# Altium schematic sheet SlotCarChannel.SchDoc
size A
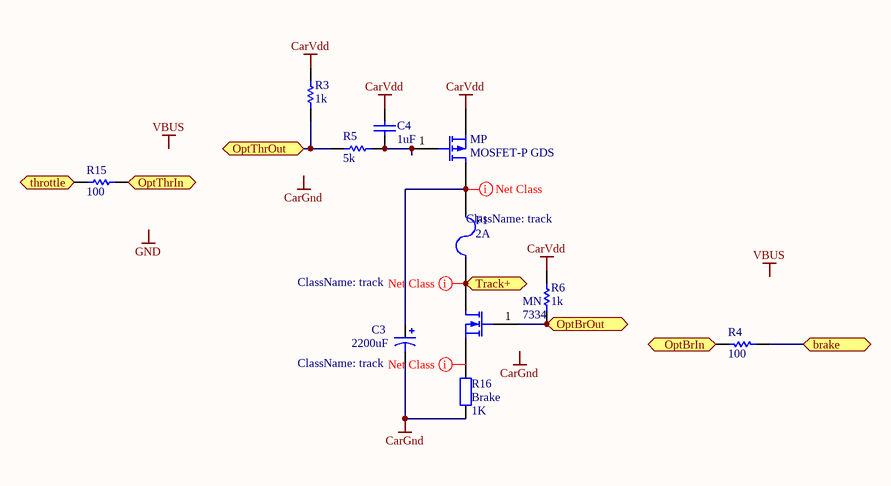
[diagram p0: SlotCarChannel.SchDoc]

## Parts
C3  2200uF  [CAPPR5-12.5x35]
C4  1uF  [CC1608-0603]
F1  2A  [2920Littelfuse]
MN  7334  [TO220_HEATSINK]
MP  MOSFET-P GDS  [TO220_HEATSINK]
R3  1k  [CR1608-0603]
R4  100  [CR1608-0603]
R5  5k  [CR1608-0603]
R6  1k  [CR1608-0603]
R15  100  [CR1608-0603]
R16  Brake  value 1K  [Axial 0.4]

## Ports
brake, OptBrIn, OptBrOut, OptThrIn, OptThrOut, throttle, Track+

## Nets
CarGnd: C3.2 R16.1
CarVdd: C4.2 MP.3(S) R3.1 R6.1
brake: R4.1 ; port brake
OptBrIn: R4.2 ; port OptBrIn
OptBrOut: MN.1(G) R6.2 ; port OptBrOut
OptThrIn: R15.2 ; port OptThrIn
OptThrOut: R3.2 R5.2 ; port OptThrOut
throttle: R15.1 ; port throttle
Track+: F1.1 MN.2(D) ; port Track+
NetC3_1: C3.1 F1.2 MP.2(D)
NetC4_1: C4.1 MP.1(G) R5.1
NetMN_3: MN.3(S) R16.2

## Layout directives
net class track; rule Undefined: NetC3_1, NetMN_3, Track+

## Notes on the sheet
- Labels drawn without touching a wire or pin: CarGnd, GND, VBUS

## Library data of the parts
C3 = Cap Pol1: Polarized Capacitor (Radial); Value: 100pF; Published: 8-Jun-2000; LatestRevisionDate: 17-Jul-2002; LatestRevisionNote: Re-released for DXP Platform.; PackageReference: RB7.6-15; Publisher: Altium Limited
C4 = Cap Semi: Capacitor (Semiconductor SIM Model); Value: 100pF; Published: 8-Jun-2000; LatestRevisionDate: 17-Jul-2002; LatestRevisionNote: Re-released for DXP Platform.; PackageReference: C1206; Publisher: Altium Limited
F1 = Fuse 2: Fuse; Published: 8-Jun-2000; LatestRevisionDate: 17-Jul-2002; LatestRevisionNote: Re-released for DXP Platform.; PackageReference: PIN-W2/E2.8; Publisher: Altium Limited
MN = MOSFET-N-GDS: N-Channel MOSFET; PackageDocument: 1995/1996; Published: 8-Jun-2000; LatestRevisionDate: 17-Jul-2002; LatestRevisionNote: Re-released for DXP Platform.; PackageReference: E3; Publisher: Altium Limited
MP = MOSFET-P-GDS: P-Channel MOSFET; PackageDocument: 1995/1996; Published: 8-Jun-2000; LatestRevisionDate: 17-Jul-2002; LatestRevisionNote: Re-released for DXP Platform.; PackageReference: E3; Publisher: Altium Limited
R3 R6 = Res Semi: Semiconductor Resistor; Published: 8-Jun-2000; LatestRevisionDate: 17-Jul-2002; LatestRevisionNote: Re-released for DXP Platform.; PackageReference: AXIAL-0.5; Publisher: Altium Limited; Value: 1K
R4 R5 R15 = Res Semi: Semiconductor Resistor; Value: 1K; Published: 8-Jun-2000; LatestRevisionDate: 17-Jul-2002; LatestRevisionNote: Re-released for DXP Platform.; PackageReference: AXIAL-0.5; Publisher: Altium Limited
R16 = Res2: Resistor; Published: 8-Jun-2000; LatestRevisionDate: 17-Jul-2002; LatestRevisionNote: Re-released for DXP Platform.; PackageReference: AXIAL-0.4; Publisher: Altium Limited